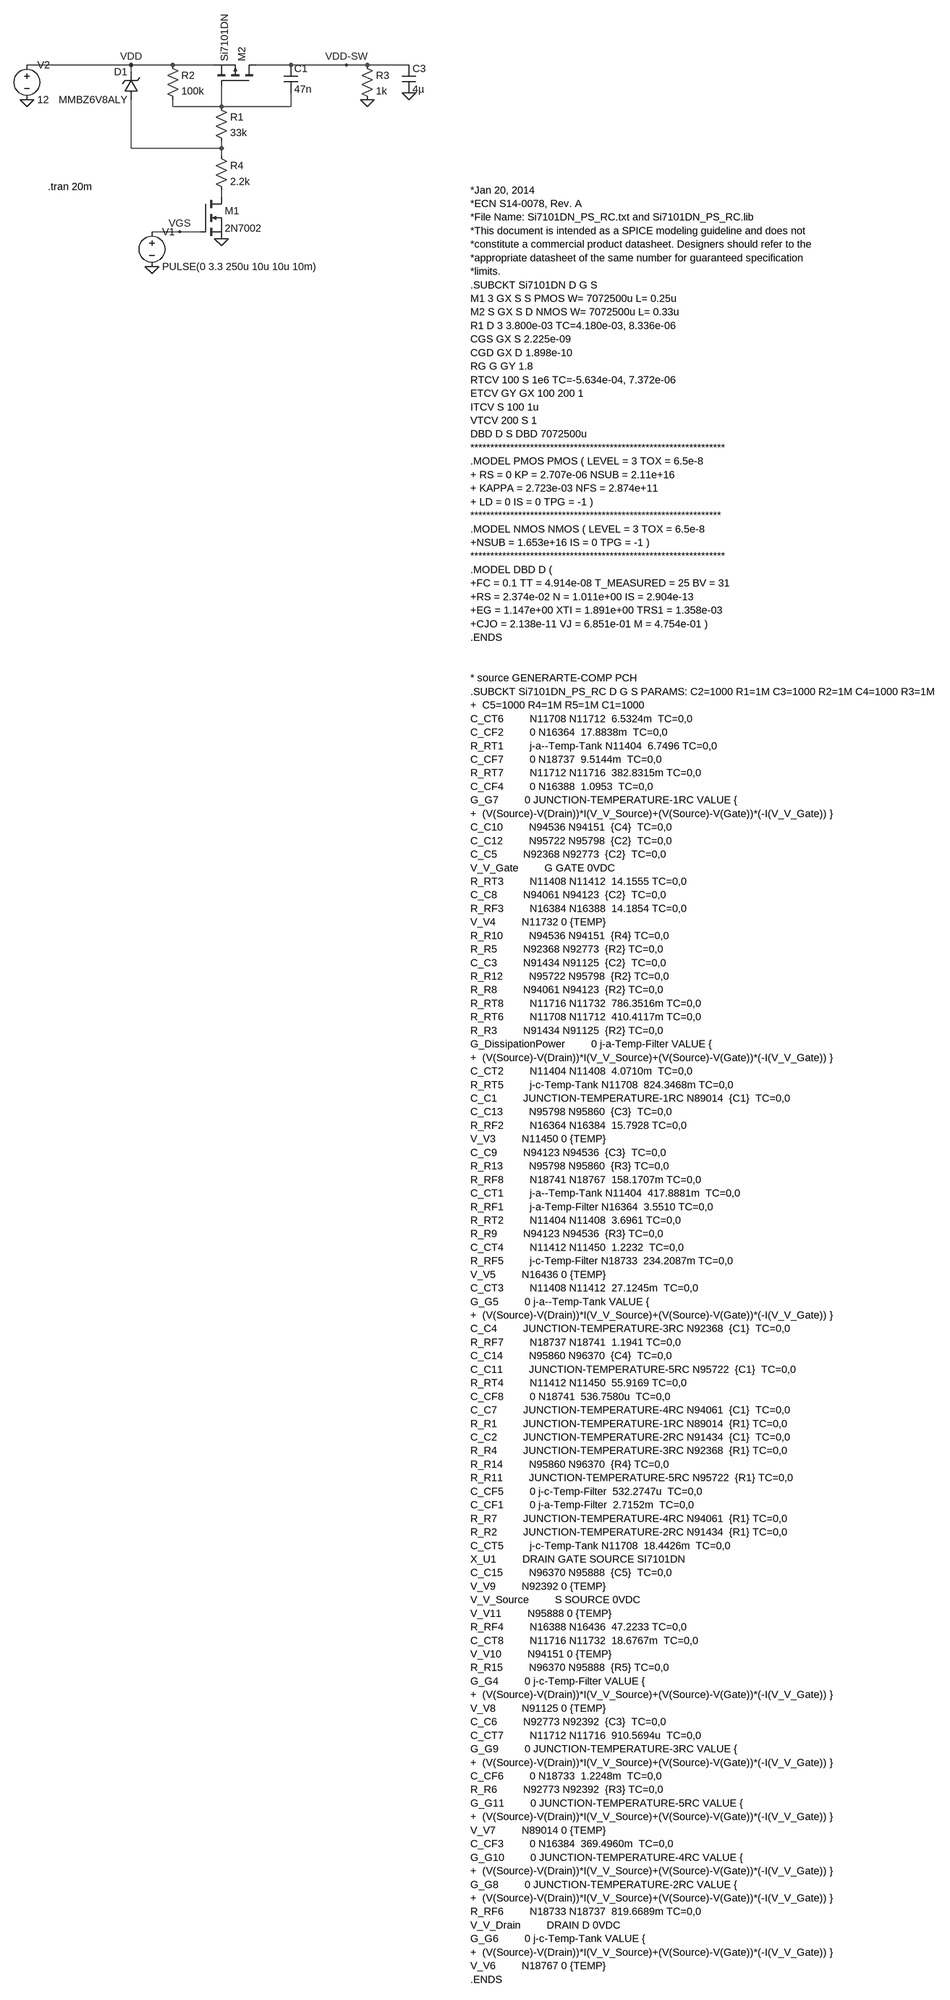
[diagram p0: schematic Key Shaping.asc]
Key Shaping.asc, the LTspice schematic file:
Version 4
SHEET 1 3216 3924
WIRE -32 -48 -272 -48
WIRE 64 -48 -32 -48
WIRE 160 -48 64 -48
WIRE 336 -48 256 -48
WIRE 464 -48 336 -48
WIRE 512 -48 464 -48
WIRE 608 -48 512 -48
WIRE -32 -32 -32 -48
WIRE 64 48 64 32
WIRE 176 48 176 0
WIRE 176 48 64 48
WIRE 336 48 336 16
WIRE 336 48 176 48
WIRE -32 144 -32 32
WIRE 176 144 176 128
WIRE 176 144 -32 144
WIRE 176 160 176 144
WIRE 176 256 176 240
WIRE 80 336 16 336
WIRE 128 336 80 336
FLAG -272 32 0
FLAG -32 -48 VDD
FLAG 176 352 0
FLAG 16 416 0
FLAG 464 -48 VDD-SW
FLAG 80 336 VGS
FLAG 512 32 0
FLAG 608 16 0
SYMBOL voltage -272 -64 R0
WINDOW 123 0 0 Left 0
WINDOW 39 0 0 Left 0
SYMATTR InstName V2
SYMATTR Value 12
SYMBOL nmos 128 256 R0
SYMATTR InstName M1
SYMATTR Value 2N7002
SYMBOL pmos 256 0 M270
SYMATTR InstName M2
SYMATTR Value Si7101DN
SYMATTR Prefix X
SYMBOL res 160 32 R0
SYMATTR InstName R1
SYMATTR Value 33k
SYMBOL res 48 -64 R0
SYMATTR InstName R2
SYMATTR Value 100k
SYMBOL cap 320 -48 R0
SYMATTR InstName C1
SYMATTR Value 47n
SYMBOL voltage 16 320 R0
WINDOW 123 0 0 Left 0
WINDOW 39 0 0 Left 0
SYMATTR InstName V1
SYMATTR Value PULSE(0 3.3 250u 10u 10u 10m)
SYMBOL res 496 -64 R0
SYMATTR InstName R3
SYMATTR Value 1k
SYMBOL cap 592 -48 R0
SYMATTR InstName C3
SYMATTR Value 4µ
SYMBOL zener -16 32 R180
WINDOW 0 24 64 Left 2
WINDOW 3 24 0 Left 2
SYMATTR InstName D1
SYMATTR Value MMBZ6V8ALY
SYMATTR Description Diode
SYMATTR Type diode
SYMBOL res 160 144 R0
SYMATTR InstName R4
SYMATTR Value 2.2k
TEXT 840 240 Left 2 !*Jan 20, 2014\n*ECN S14-0078, Rev. A\n*File Name: Si7101DN_PS_RC.txt and Si7101DN_PS_RC.lib\n*This document is intended as a SPICE modeling guideline and does not\n*constitute a commercial product datasheet. Designers should refer to the\n*appropriate datasheet of the same number for guaranteed specification\n*limits.\n.SUBCKT Si7101DN D G S \nM1 3 GX S S PMOS W= 7072500u L= 0.25u \nM2 S GX S D NMOS W= 7072500u L= 0.33u \nR1 D 3 3.800e-03 TC=4.180e-03, 8.336e-06 \nCGS GX S 2.225e-09 \nCGD GX D 1.898e-10 \nRG G GY 1.8 \nRTCV 100 S 1e6 TC=-5.634e-04, 7.372e-06 \nETCV GY GX 100 200 1 \nITCV S 100 1u \nVTCV 200 S 1 \nDBD D S DBD 7072500u \n**************************************************************** \n.MODEL PMOS PMOS ( LEVEL = 3 TOX = 6.5e-8 \n+ RS = 0 KP = 2.707e-06 NSUB = 2.11e+16 \n+ KAPPA = 2.723e-03 NFS = 2.874e+11 \n+ LD = 0 IS = 0 TPG = -1 ) \n*************************************************************** \n.MODEL NMOS NMOS ( LEVEL = 3 TOX = 6.5e-8 \n+NSUB = 1.653e+16 IS = 0 TPG = -1 ) \n**************************************************************** \n.MODEL DBD D ( \n+FC = 0.1 TT = 4.914e-08 T_MEASURED = 25 BV = 31 \n+RS = 2.374e-02 N = 1.011e+00 IS = 2.904e-13 \n+EG = 1.147e+00 XTI = 1.891e+00 TRS1 = 1.358e-03 \n+CJO = 2.138e-11 VJ = 6.851e-01 M = 4.754e-01 ) \n.ENDS \n \n\n* source GENERARTE-COMP PCH\n.SUBCKT Si7101DN_PS_RC D G S PARAMS: C2=1000 R1=1M C3=1000 R2=1M C4=1000 R3=1M\n+  C5=1000 R4=1M R5=1M C1=1000\nC_CT6         N11708 N11712  6.5324m  TC=0,0 \nC_CF2         0 N16364  17.8838m  TC=0,0 \nR_RT1         j-a--Temp-Tank N11404  6.7496 TC=0,0 \nC_CF7         0 N18737  9.5144m  TC=0,0 \nR_RT7         N11712 N11716  382.8315m TC=0,0 \nC_CF4         0 N16388  1.0953  TC=0,0 \nG_G7         0 JUNCTION-TEMPERATURE-1RC VALUE {\n+  (V(Source)-V(Drain))*I(V_V_Source)+(V(Source)-V(Gate))*(-I(V_V_Gate)) }\nC_C10         N94536 N94151  {C4}  TC=0,0 \nC_C12         N95722 N95798  {C2}  TC=0,0 \nC_C5         N92368 N92773  {C2}  TC=0,0 \nV_V_Gate         G GATE 0VDC\nR_RT3         N11408 N11412  14.1555 TC=0,0 \nC_C8         N94061 N94123  {C2}  TC=0,0 \nR_RF3         N16384 N16388  14.1854 TC=0,0 \nV_V4         N11732 0 {TEMP}\nR_R10         N94536 N94151  {R4} TC=0,0 \nR_R5         N92368 N92773  {R2} TC=0,0 \nC_C3         N91434 N91125  {C2}  TC=0,0 \nR_R12         N95722 N95798  {R2} TC=0,0 \nR_R8         N94061 N94123  {R2} TC=0,0 \nR_RT8         N11716 N11732  786.3516m TC=0,0 \nR_RT6         N11708 N11712  410.4117m TC=0,0 \nR_R3         N91434 N91125  {R2} TC=0,0 \nG_DissipationPower         0 j-a-Temp-Filter VALUE {\n+  (V(Source)-V(Drain))*I(V_V_Source)+(V(Source)-V(Gate))*(-I(V_V_Gate)) }\nC_CT2         N11404 N11408  4.0710m  TC=0,0 \nR_RT5         j-c-Temp-Tank N11708  824.3468m TC=0,0 \nC_C1         JUNCTION-TEMPERATURE-1RC N89014  {C1}  TC=0,0 \nC_C13         N95798 N95860  {C3}  TC=0,0 \nR_RF2         N16364 N16384  15.7928 TC=0,0 \nV_V3         N11450 0 {TEMP}\nC_C9         N94123 N94536  {C3}  TC=0,0 \nR_R13         N95798 N95860  {R3} TC=0,0 \nR_RF8         N18741 N18767  158.1707m TC=0,0 \nC_CT1         j-a--Temp-Tank N11404  417.8881m  TC=0,0 \nR_RF1         j-a-Temp-Filter N16364  3.5510 TC=0,0 \nR_RT2         N11404 N11408  3.6961 TC=0,0 \nR_R9         N94123 N94536  {R3} TC=0,0 \nC_CT4         N11412 N11450  1.2232  TC=0,0 \nR_RF5         j-c-Temp-Filter N18733  234.2087m TC=0,0 \nV_V5         N16436 0 {TEMP}\nC_CT3         N11408 N11412  27.1245m  TC=0,0 \nG_G5         0 j-a--Temp-Tank VALUE {\n+  (V(Source)-V(Drain))*I(V_V_Source)+(V(Source)-V(Gate))*(-I(V_V_Gate)) }\nC_C4         JUNCTION-TEMPERATURE-3RC N92368  {C1}  TC=0,0 \nR_RF7         N18737 N18741  1.1941 TC=0,0 \nC_C14         N95860 N96370  {C4}  TC=0,0 \nC_C11         JUNCTION-TEMPERATURE-5RC N95722  {C1}  TC=0,0 \nR_RT4         N11412 N11450  55.9169 TC=0,0 \nC_CF8         0 N18741  536.7580u  TC=0,0 \nC_C7         JUNCTION-TEMPERATURE-4RC N94061  {C1}  TC=0,0 \nR_R1         JUNCTION-TEMPERATURE-1RC N89014  {R1} TC=0,0 \nC_C2         JUNCTION-TEMPERATURE-2RC N91434  {C1}  TC=0,0 \nR_R4         JUNCTION-TEMPERATURE-3RC N92368  {R1} TC=0,0 \nR_R14         N95860 N96370  {R4} TC=0,0 \nR_R11         JUNCTION-TEMPERATURE-5RC N95722  {R1} TC=0,0 \nC_CF5         0 j-c-Temp-Filter  532.2747u  TC=0,0 \nC_CF1         0 j-a-Temp-Filter  2.7152m  TC=0,0 \nR_R7         JUNCTION-TEMPERATURE-4RC N94061  {R1} TC=0,0 \nR_R2         JUNCTION-TEMPERATURE-2RC N91434  {R1} TC=0,0 \nC_CT5         j-c-Temp-Tank N11708  18.4426m  TC=0,0 \nX_U1         DRAIN GATE SOURCE SI7101DN \nC_C15         N96370 N95888  {C5}  TC=0,0 \nV_V9         N92392 0 {TEMP}\nV_V_Source         S SOURCE 0VDC\nV_V11         N95888 0 {TEMP}\nR_RF4         N16388 N16436  47.2233 TC=0,0 \nC_CT8         N11716 N11732  18.6767m  TC=0,0 \nV_V10         N94151 0 {TEMP}\nR_R15         N96370 N95888  {R5} TC=0,0 \nG_G4         0 j-c-Temp-Filter VALUE {\n+  (V(Source)-V(Drain))*I(V_V_Source)+(V(Source)-V(Gate))*(-I(V_V_Gate)) }\nV_V8         N91125 0 {TEMP}\nC_C6         N92773 N92392  {C3}  TC=0,0 \nC_CT7         N11712 N11716  910.5694u  TC=0,0 \nG_G9         0 JUNCTION-TEMPERATURE-3RC VALUE {\n+  (V(Source)-V(Drain))*I(V_V_Source)+(V(Source)-V(Gate))*(-I(V_V_Gate)) }\nC_CF6         0 N18733  1.2248m  TC=0,0 \nR_R6         N92773 N92392  {R3} TC=0,0 \nG_G11         0 JUNCTION-TEMPERATURE-5RC VALUE {\n+  (V(Source)-V(Drain))*I(V_V_Source)+(V(Source)-V(Gate))*(-I(V_V_Gate)) }\nV_V7         N89014 0 {TEMP}\nC_CF3         0 N16384  369.4960m  TC=0,0 \nG_G10         0 JUNCTION-TEMPERATURE-4RC VALUE {\n+  (V(Source)-V(Drain))*I(V_V_Source)+(V(Source)-V(Gate))*(-I(V_V_Gate)) }\nG_G8         0 JUNCTION-TEMPERATURE-2RC VALUE {\n+  (V(Source)-V(Drain))*I(V_V_Source)+(V(Source)-V(Gate))*(-I(V_V_Gate)) }\nR_RF6         N18733 N18737  819.6689m TC=0,0 \nV_V_Drain         DRAIN D 0VDC\nG_G6         0 j-c-Temp-Tank VALUE {\n+  (V(Source)-V(Drain))*I(V_V_Source)+(V(Source)-V(Gate))*(-I(V_V_Gate)) }\nV_V6         N18767 0 {TEMP}\n.ENDS
TEXT -224 232 Left 2 !.tran 20m

The netlist it stands for:
* Key Shaping.asc
V2 VDD 0 12
M1 N003 VGS 0 0 2N7002
XM2 VDD-SW N001 VDD Si7101DN  ; pins D G S
R1 N001 N002 33k
R2 VDD N001 100k
C1 VDD-SW N001 47n
V1 VGS 0 PULSE(0 3.3 250u 10u 10u 10m)
R3 VDD-SW 0 1k
C3 VDD-SW 0 4µ
D1 N002 VDD MMBZ6V8ALY
R4 N002 N003 2.2k
.model D D
.lib standard.dio
.model NMOS NMOS
.model PMOS PMOS
.lib standard.mos
*Jan 20, 2014
*ECN S14-0078, Rev. A
*File Name: Si7101DN_PS_RC.txt and Si7101DN_PS_RC.lib
*This document is intended as a SPICE modeling guideline and does not
*constitute a commercial product datasheet. Designers should refer to the
*appropriate datasheet of the same number for guaranteed specification
*limits.
.SUBCKT Si7101DN D G S
M1 3 GX S S PMOS W= 7072500u L= 0.25u
M2 S GX S D NMOS W= 7072500u L= 0.33u
R1 D 3 3.800e-03 TC=4.180e-03, 8.336e-06
CGS GX S 2.225e-09
CGD GX D 1.898e-10
RG G GY 1.8
RTCV 100 S 1e6 TC=-5.634e-04, 7.372e-06
ETCV GY GX 100 200 1
ITCV S 100 1u
VTCV 200 S 1
DBD D S DBD 7072500u
****************************************************************
.MODEL PMOS PMOS ( LEVEL = 3 TOX = 6.5e-8
+ RS = 0 KP = 2.707e-06 NSUB = 2.11e+16
+ KAPPA = 2.723e-03 NFS = 2.874e+11
+ LD = 0 IS = 0 TPG = -1 )
***************************************************************
.MODEL NMOS NMOS ( LEVEL = 3 TOX = 6.5e-8
+NSUB = 1.653e+16 IS = 0 TPG = -1 )
****************************************************************
.MODEL DBD D (
+FC = 0.1 TT = 4.914e-08 T_MEASURED = 25 BV = 31
+RS = 2.374e-02 N = 1.011e+00 IS = 2.904e-13
+EG = 1.147e+00 XTI = 1.891e+00 TRS1 = 1.358e-03
+CJO = 2.138e-11 VJ = 6.851e-01 M = 4.754e-01 )
.ENDS
* source GENERARTE-COMP PCH
.SUBCKT Si7101DN_PS_RC D G S PARAMS: C2=1000 R1=1M C3=1000 R2=1M C4=1000 R3=1M
+  C5=1000 R4=1M R5=1M C1=1000
C_CT6         N11708 N11712  6.5324m  TC=0,0
C_CF2         0 N16364  17.8838m  TC=0,0
R_RT1         j-a--Temp-Tank N11404  6.7496 TC=0,0
C_CF7         0 N18737  9.5144m  TC=0,0
R_RT7         N11712 N11716  382.8315m TC=0,0
C_CF4         0 N16388  1.0953  TC=0,0
G_G7         0 JUNCTION-TEMPERATURE-1RC VALUE {
+  (V(Source)-V(Drain))*I(V_V_Source)+(V(Source)-V(Gate))*(-I(V_V_Gate)) }
C_C10         N94536 N94151  {C4}  TC=0,0
C_C12         N95722 N95798  {C2}  TC=0,0
C_C5         N92368 N92773  {C2}  TC=0,0
V_V_Gate         G GATE 0VDC
R_RT3         N11408 N11412  14.1555 TC=0,0
C_C8         N94061 N94123  {C2}  TC=0,0
R_RF3         N16384 N16388  14.1854 TC=0,0
V_V4         N11732 0 {TEMP}
R_R10         N94536 N94151  {R4} TC=0,0
R_R5         N92368 N92773  {R2} TC=0,0
C_C3         N91434 N91125  {C2}  TC=0,0
R_R12         N95722 N95798  {R2} TC=0,0
R_R8         N94061 N94123  {R2} TC=0,0
R_RT8         N11716 N11732  786.3516m TC=0,0
R_RT6         N11708 N11712  410.4117m TC=0,0
R_R3         N91434 N91125  {R2} TC=0,0
G_DissipationPower         0 j-a-Temp-Filter VALUE {
+  (V(Source)-V(Drain))*I(V_V_Source)+(V(Source)-V(Gate))*(-I(V_V_Gate)) }
C_CT2         N11404 N11408  4.0710m  TC=0,0
R_RT5         j-c-Temp-Tank N11708  824.3468m TC=0,0
C_C1         JUNCTION-TEMPERATURE-1RC N89014  {C1}  TC=0,0
C_C13         N95798 N95860  {C3}  TC=0,0
R_RF2         N16364 N16384  15.7928 TC=0,0
V_V3         N11450 0 {TEMP}
C_C9         N94123 N94536  {C3}  TC=0,0
R_R13         N95798 N95860  {R3} TC=0,0
R_RF8         N18741 N18767  158.1707m TC=0,0
C_CT1         j-a--Temp-Tank N11404  417.8881m  TC=0,0
R_RF1         j-a-Temp-Filter N16364  3.5510 TC=0,0
R_RT2         N11404 N11408  3.6961 TC=0,0
R_R9         N94123 N94536  {R3} TC=0,0
C_CT4         N11412 N11450  1.2232  TC=0,0
R_RF5         j-c-Temp-Filter N18733  234.2087m TC=0,0
V_V5         N16436 0 {TEMP}
C_CT3         N11408 N11412  27.1245m  TC=0,0
G_G5         0 j-a--Temp-Tank VALUE {
+  (V(Source)-V(Drain))*I(V_V_Source)+(V(Source)-V(Gate))*(-I(V_V_Gate)) }
C_C4         JUNCTION-TEMPERATURE-3RC N92368  {C1}  TC=0,0
R_RF7         N18737 N18741  1.1941 TC=0,0
C_C14         N95860 N96370  {C4}  TC=0,0
C_C11         JUNCTION-TEMPERATURE-5RC N95722  {C1}  TC=0,0
R_RT4         N11412 N11450  55.9169 TC=0,0
C_CF8         0 N18741  536.7580u  TC=0,0
C_C7         JUNCTION-TEMPERATURE-4RC N94061  {C1}  TC=0,0
R_R1         JUNCTION-TEMPERATURE-1RC N89014  {R1} TC=0,0
C_C2         JUNCTION-TEMPERATURE-2RC N91434  {C1}  TC=0,0
R_R4         JUNCTION-TEMPERATURE-3RC N92368  {R1} TC=0,0
R_R14         N95860 N96370  {R4} TC=0,0
R_R11         JUNCTION-TEMPERATURE-5RC N95722  {R1} TC=0,0
C_CF5         0 j-c-Temp-Filter  532.2747u  TC=0,0
C_CF1         0 j-a-Temp-Filter  2.7152m  TC=0,0
R_R7         JUNCTION-TEMPERATURE-4RC N94061  {R1} TC=0,0
R_R2         JUNCTION-TEMPERATURE-2RC N91434  {R1} TC=0,0
C_CT5         j-c-Temp-Tank N11708  18.4426m  TC=0,0
X_U1         DRAIN GATE SOURCE SI7101DN
C_C15         N96370 N95888  {C5}  TC=0,0
V_V9         N92392 0 {TEMP}
V_V_Source         S SOURCE 0VDC
V_V11         N95888 0 {TEMP}
R_RF4         N16388 N16436  47.2233 TC=0,0
C_CT8         N11716 N11732  18.6767m  TC=0,0
V_V10         N94151 0 {TEMP}
R_R15         N96370 N95888  {R5} TC=0,0
G_G4         0 j-c-Temp-Filter VALUE {
+  (V(Source)-V(Drain))*I(V_V_Source)+(V(Source)-V(Gate))*(-I(V_V_Gate)) }
V_V8         N91125 0 {TEMP}
C_C6         N92773 N92392  {C3}  TC=0,0
C_CT7         N11712 N11716  910.5694u  TC=0,0
G_G9         0 JUNCTION-TEMPERATURE-3RC VALUE {
+  (V(Source)-V(Drain))*I(V_V_Source)+(V(Source)-V(Gate))*(-I(V_V_Gate)) }
C_CF6         0 N18733  1.2248m  TC=0,0
R_R6         N92773 N92392  {R3} TC=0,0
G_G11         0 JUNCTION-TEMPERATURE-5RC VALUE {
+  (V(Source)-V(Drain))*I(V_V_Source)+(V(Source)-V(Gate))*(-I(V_V_Gate)) }
V_V7         N89014 0 {TEMP}
C_CF3         0 N16384  369.4960m  TC=0,0
G_G10         0 JUNCTION-TEMPERATURE-4RC VALUE {
+  (V(Source)-V(Drain))*I(V_V_Source)+(V(Source)-V(Gate))*(-I(V_V_Gate)) }
G_G8         0 JUNCTION-TEMPERATURE-2RC VALUE {
+  (V(Source)-V(Drain))*I(V_V_Source)+(V(Source)-V(Gate))*(-I(V_V_Gate)) }
R_RF6         N18733 N18737  819.6689m TC=0,0
V_V_Drain         DRAIN D 0VDC
G_G6         0 j-c-Temp-Tank VALUE {
+  (V(Source)-V(Drain))*I(V_V_Source)+(V(Source)-V(Gate))*(-I(V_V_Gate)) }
V_V6         N18767 0 {TEMP}
.ENDS
.tran 20m
.backanno
.end